# Altium schematic sheet JTAG_Interface.SchDoc
size A4
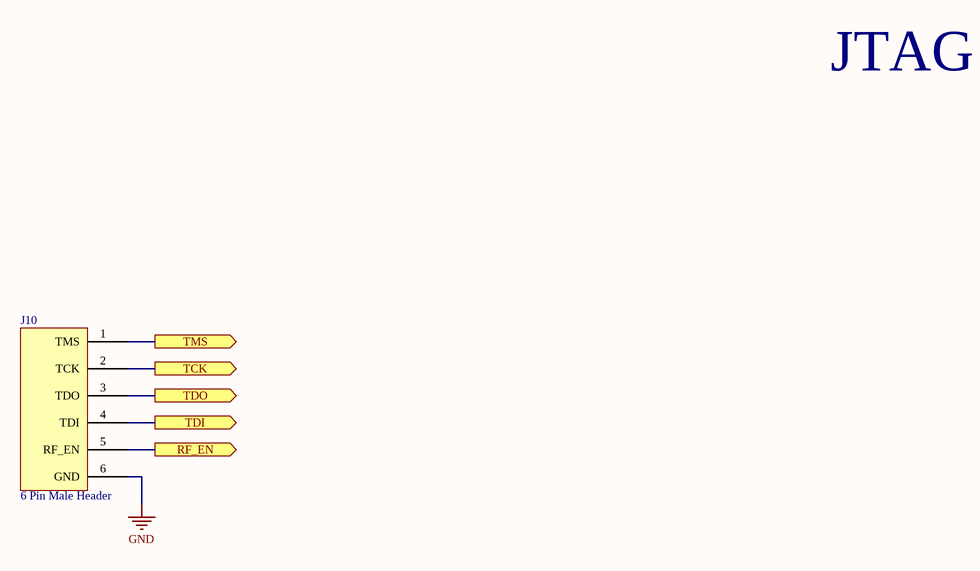
[diagram p0: JTAG_Interface.SchDoc]

## Parts
J10  6 Pin Male Header  [DS1029-01]

## Ports
RF_EN (out), TCK (out), TDI (out), TDO (out), TMS (out)

## Nets
GND: J10.6(GND)
RF_EN: J10.5(RF_EN) ; port RF_EN
TCK: J10.2(TCK) ; port TCK
TDI: J10.4(TDI) ; port TDI
TDO: J10.3(TDO) ; port TDO
TMS: J10.1(TMS) ; port TMS

## Notes on the sheet
- JTAG

## Library data of the parts
J10 = DS1029-01